# Altium project AMC_FMC_Carrier.PrjPcb (part 5 of 7)

## Sheet Thermometers.SchDoc
size A4; DocumentNumber: 12; SheetNumber: 12; SheetTotal: 30
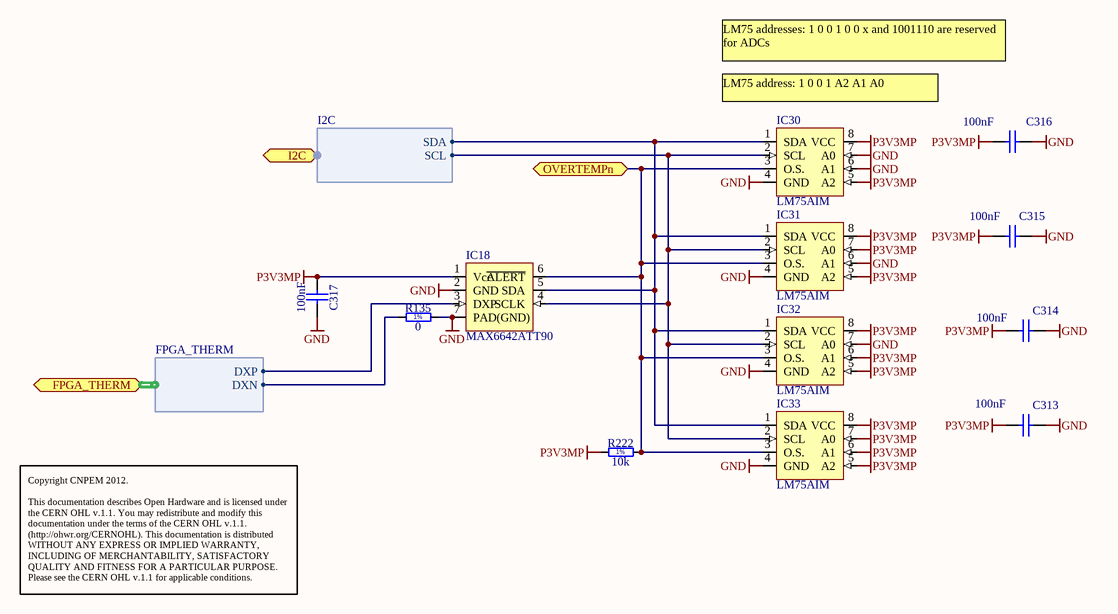
[diagram p13: Thermometers.SchDoc]

### Parts
C313  100nF  [CAPC0603X33N]
C314  100nF  [CAPC0603X33N]
C315  100nF  [CAPC0603X33N]
C316  100nF  [CAPC0603X33N]
C317  100nF  [CAPC0603X33N]
IC18  MAX6642ATT90  [TFDN6]
IC30  LM75AIM  [SOIC127P600X175-8N]
IC31  LM75AIM  [SOIC127P600X175-8N]
IC32  LM75AIM  [SOIC127P600X175-8N]
IC33  LM75AIM  [SOIC127P600X175-8N]
R135  0  [RESC1005X40N]
R222  10k  [RESC1005X40N]

### Ports
FPGA_THERM (harness FPGA_THERM), I2C (harness I2C), OVERTEMPn (bidir)

### Harnesses
FPGA_THERM: DXN, DXP
I2C: SCL, SDA

### Nets
GND: C313.2 C314.2 C315.2 C316.2 C317.2 IC18.2(GND) IC18.7(PAD(GND)) IC30.4(GND) IC30.6(A1) IC30.7(A0) IC31.4(GND) IC31.6(A1) IC32.4(GND) IC32.7(A0) IC33.4(GND) R135.2
P3V3MP: C313.1 C314.1 C315.1 C316.1 C317.1 IC18.1(Vcc) IC30.5(A2) IC30.8(VCC) IC31.5(A2) IC31.7(A0) IC31.8(VCC) IC32.5(A2) IC32.6(A1) IC32.8(VCC) IC33.5(A2) IC33.6(A1) IC33.7(A0) IC33.8(VCC) R222.1
FPGA_ALERTn: IC18.6(~{ALERT}) IC30.3(O.S.) IC31.3(O.S.) IC32.3(O.S.) IC33.3(O.S.) R222.2 ; port OVERTEMPn
FTMP.DXN: R135.1 ; port FPGA_THERM.DXN
FTMP.DXP: IC18.3(DXP) ; port FPGA_THERM.DXP
I2C_CPU.SCL: IC18.4(SCLK) IC30.2(SCL) IC31.2(SCL) IC32.2(SCL) IC33.2(SCL) ; port I2C.SCL
I2C_CPU.SDA: IC18.5(SDA) IC30.1(SDA) IC31.1(SDA) IC32.1(SDA) IC33.1(SDA) ; port I2C.SDA

### Notes on the sheet
- (near IC30) LM75 address: 1 0 0 1 A2 A1 A0
- LM75 addresses: 1 0 0 1 0 0 x and 1001110 are reserved for ADCs
- Copyright CNPEM 2012.
  This documentation describes Open Hardware and is licensed under the CERN OHL v.1.1. You may redistribute and modify this documentation under the terms of the CERN OHL v.1.1. (http://ohwr.org/CERNOHL). This documentation is distributed WITHOUT ANY EXPRESS OR IMPLIED WARRANTY, INCLUDING OF MERCHANTABILITY, SATISFACTORY QUALITY AND FITNESS FOR A PARTICULAR PURPOSE. Please see the CERN OHL v.1.1 for applicable conditions.
- (in symbol R0402_0R_JUMPER) 1%
- (in symbol R0402_10K_1%_0.0625W_100PPM) 1%

### Library data of the parts
C313-C317 = CC0201_100NF_6.3V_10%_X5R: as C616-C621 on sheet UI_mon; Part Number: CC0201_100NF_6.3V_10%_X5R; Component Kind: Standard; Component Type: Standard; Pin Count: 2; Value: 100nF; Status: Not Recommended; Manufacturer Part Number: CC0201_100NF_6.3V_10%_X5R; Case: 0201; Mounted: Yes; Socket: No; SMD: Yes; Manufacturer1 Example: AVX; Manufacturer1 ComponentHeight: 0.33mm; HelpURL: \\cern.ch\dfs\Applications\Altium\Datasheets\CC0201_X5R_AVX.pdf; Author: CERN DEM JLC; CreateDate: 2007-12-03; LatestRevisionDate: 2007-12-03
IC18 = SENS_MAX6642: ±1°C, SMBus- Remote/Local Temperature Sensor with Overtemperature Alarm; Supplier 1: Digi-Key; Supplier Part Number 1: MAX6642ATT90+TCT-ND
IC30-IC33 = SENS_LM75: I2C temperature sensor
R135 = R0402_0R_JUMPER: Resistor - 1%; Part Description: 1A (0.05R Max DC Resistance) Zero Ohm Jumper; Manufacturer: GENERIC; Manufacturer1 Part Number: 232270591001L; Table: Resistors SMD; Part Number: R0402_0R_JUMPER; Component Kind: Standard; Component Type: Standard; Pin Count: 2; Value: 0; Status: Not recommended; Manufacturer Part Number: R0402_0R_JUMPER; Case: 0402; Mounted: Yes; Socket: No; SMD: Yes; Manufacturer1 Example: YAGEO PHYCOMP; Manufacturer1 ComponentHeight: 0.4mm; HelpURL: \\cern.ch\dfs\Applications\Altium\Datasheets\R0402_Phycomp_RC0402.pdf; Author: CERN DEM JLC; CreateDate: 2007-12-03; LatestRevisionDate: 2012-10-17
R222 = R0402_10K_1%_0.0625W_100PPM: Resistor - 1%; Part Description: General Purpose Thick Film Chip Resistor; Manufacturer: GENERIC; Manufacturer1 Part Number: 232270671003L; TC: ±100ppm/°C; Table: Resistors SMD; Part Number: R0402_10K_1%_0.0625W_100PPM; Component Kind: Standard; Component Type: Standard; Pin Count: 2; Value: 10k; Status: Not recommended; Power: 0.0625W; Tolerance: ±1%; Manufacturer Part Number: R0402_10K_1%_0.0625W_100PPM; Case: 0402; Mounted: Yes; Socket: No; SMD: Yes; Manufacturer1 Example: YAGEO PHYCOMP; Manufacturer1 ComponentHeight: 0.4mm; HelpURL: \\cern.ch\dfs\Applications\Altium\Datasheets\R0402_Phycomp_RC0402.pdf; Author: CERN DEM JLC; CreateDate: 2007-12-03; LatestRevisionDate: 2012-10-17

## Sheet USB_UART.SchDoc
size A4; DocumentNumber: 29; SheetNumber: 29; SheetTotal: 30
Used 2 times, as channels IPMI/UUART, UUART. Parts and nets are listed once, with the designators drawn on the sheet.
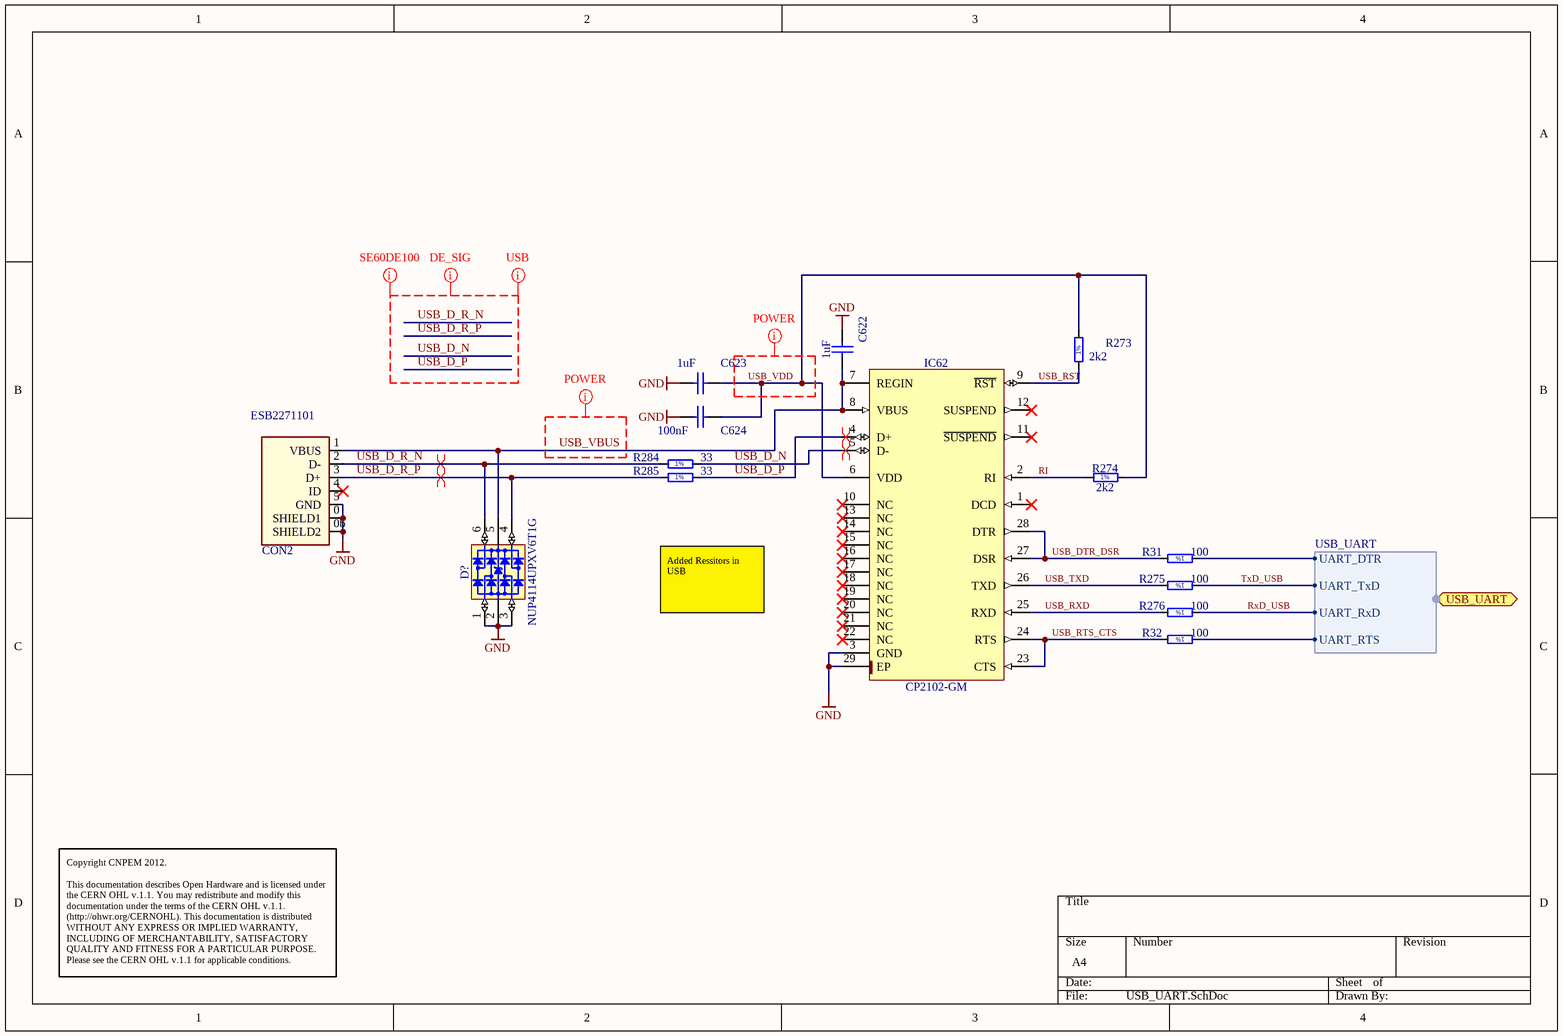
[diagram p14: USB_UART.SchDoc]

### Parts
C622  1uF  [CAPC1608X87N]
C623  1uF  [CAPC1608X87N]
C624  100nF  [CAPC0603X33N]
CON2  ESB2271101  [USB_MICRO_ESB2271101]
D?  NUP4114UPXV6T1G  [SOTFL50P160X60-6N]
IC62  CP2102-GM  [QFN50P500X500X100-29N-S335]
R31  100  [RESC1005X40N]
R32  100  [RESC1005X40N]
R273  2k2  [RESC1005X40N]
R274  2k2  [RESC1005X40N]
R275  100  [RESC1005X40N]
R276  100  [RESC1005X40N]
R284  33  [RESC1005X40N]
R285  33  [RESC1005X40N]

### Ports
USB_UART (harness USB_UART)

### Harnesses
USB_UART: UART_DTR, UART_TxD, UART_RxD, UART_RTS

### Nets
GND: C622.1 C623.1 C624.1 CON2.0(SHIELD1) CON2.0a(SHIELD1) CON2.0b(SHIELD2) CON2.0c(SHIELD2) CON2.5(GND) D?.1(I/O1) D?.2(GND) D?.3(I/O2) IC62.3(GND) IC62.29(EP)
RI: IC62.2(RI) R274.1
RxD_USB: R276.1 ; port USB_UART.UART_RxD
TxD_USB: R275.1 ; port USB_UART.UART_TxD
USB_D_N: IC62.5(D-) R284.2
USB_D_P: IC62.4(D+) R285.2
USB_D_R_N: CON2.2(D-) D?.6(I/O4) R284.1
USB_D_R_P: CON2.3(D+) D?.4(I/O3) R285.1
USB_DTR_DSR: IC62.27(DSR) IC62.28(DTR) R31.2
USB_RST: IC62.9(~{RST}) R273.1
USB_RTS_CTS: IC62.23(CTS) IC62.24(RTS) R32.2
USB_RXD: IC62.25(RXD) R276.2
USB_TXD: IC62.26(TXD) R275.2
USB_VBUS: C622.2 CON2.1(VBUS) D?.5(VBUS) IC62.7(REGIN) IC62.8(VBUS)
USB_VDD: C623.2 C624.2 IC62.6(VDD) R273.2 R274.2
NetR31_1: R31.1 ; port USB_UART.UART_DTR
NetR32_1: R32.1 ; port USB_UART.UART_RTS

Not connected (* = marked no-connect by the designer): CON2 4(ID)*; IC62 1(DCD)* 10(NC)* 11(~{SUSPEND})* 12(SUSPEND)* 13(NC)* 14(NC)* 15(NC)* 16(NC)* 17(NC)* 18(NC)* 19(NC)* 20(NC)* 21(NC)* 22(NC)*

### Channels
IPMI/UUART: designators end in A
UUART: designators end in B

### Layout directives
differential pair: USB_D_N_UUART, USB_D_P_UUART, USB_D_R_N_UUART, USB_D_R_P_UUART
net class POWER: USB_VBUS, USB_VDD
net class SE60DE100: USB_D_N, USB_D_P, USB_D_R_N, USB_D_R_P
net class DE_SIG: USB_D_N, USB_D_P, USB_D_R_N, USB_D_R_P
net class USB: USB_D_N, USB_D_P, USB_D_R_N, USB_D_R_P

### Notes on the sheet
- Added Ressitors in USB
- Copyright CNPEM 2012.
  This documentation describes Open Hardware and is licensed under the CERN OHL v.1.1. You may redistribute and modify this documentation under the terms of the CERN OHL v.1.1. (http://ohwr.org/CERNOHL). This documentation is distributed WITHOUT ANY EXPRESS OR IMPLIED WARRANTY, INCLUDING OF MERCHANTABILITY, SATISFACTORY QUALITY AND FITNESS FOR A PARTICULAR PURPOSE. Please see the CERN OHL v.1.1 for applicable conditions.
- (in symbol R0402_2K2_1%_0.0625W_100PPM) 1%
- (in symbol R0402_33R_1%_0.0625W_100PPM) 1%
- (in symbol R0402_100R_1%_0.0625W_100PPM) 1%

### Library data of the parts
C622 C623 = CC0603_1UF_16V_10%_X7R: Non-polarised capacitor; Part Description: SMD Multilayer Chip Ceramic Capacitor; Manufacturer: GENERIC; Manufacturer1 Part Number: 223824613663; Voltage: 16V; TC: X7R; Tolerance: ±10%; Table: Capacitors SMD; Part Number: CC0603_1UF_16V_10%_X7R; Component Kind: Standard; Component Type: Standard; Pin Count: 2; Value: 1uF; Status: Preferred; Manufacturer Part Number: CC0603_1uF_16V_10%_X7R; Case: 0603; Mounted: Yes; Socket: No; SMD: Yes; Manufacturer1 Example: PHYCOMP; Manufacturer1 ComponentHeight: 0.87mm; HelpURL: \\cern.ch\dfs\Applications\Altium\Datasheets\CC0805_X5R_PHYCOMP_HC.pdf; Author: CERN DEM JLC; CreateDate: 2007-12-03; LatestRevisionDate: 2007-12-03
C624 = CC0201_100NF_6.3V_10%_X5R: as C616-C621 on sheet UI_mon; Part Number: CC0201_100NF_6.3V_10%_X5R; Component Kind: Standard; Component Type: Standard; Pin Count: 2; Value: 100nF; Status: Not Recommended; Manufacturer Part Number: CC0201_100NF_6.3V_10%_X5R; Case: 0201; Mounted: Yes; Socket: No; SMD: Yes; Manufacturer1 Example: AVX; Manufacturer1 ComponentHeight: 0.33mm; HelpURL: \\cern.ch\dfs\Applications\Altium\Datasheets\CC0201_X5R_AVX.pdf; Author: CERN DEM JLC; CreateDate: 2007-12-03; LatestRevisionDate: 2007-12-03
CON2 = CON_USB_AB_MICRO: USB micro AB connector; Part Number: 10133; Device: USB_Mini_AB
D? = NUP4114UPXV6T1G: Part Description: ESD Protection Diodes Array (8kV) with Low Clamping Voltage; Manufacturer: ON SEMICONDUCTOR; Voltage: 5.5V; PressFit: No; Bonding: No; Part Number: NUP4114UPXV6T1G; Component Kind: Standard; Component Type: Standard; Device: NUP4114UPXV6T1G; PackageDescription: SOTFL (SOT666, SOT563,), 0.50mm, Pitch; 6 Pin, 1.20mm W X 1.60mm L X 0.60mm H Body, IPC Medium Density; Manufacturer Part Number: NUP4114UPXV6T1G; Pin Count: 8; Mounted: Yes; Socket: No; SMD: Yes; Sense: No; ComponentHeight: 1.75mm; HelpURL: \\cern.ch\dfs\Applications\Altium\Datasheets\NUP4114UPXV6T1G.pdf; Author: CERN DEM JLC; CreateDate: 05/12/2012; LatestRevisionDate: 05/12/2012
IC62 = CP2102-GM: Single-Chip USB to UART Bridge; Manufacturer: SILICON LABS; Table: Analog & Interface; Part Number: CP2102-GM; Component Kind: Standard; Component Type: Standard; Device: CP2102-GM; PackageDescription: QFN, 0.50mm Pitch, Square; 28 pin, 5.00mm L X 5.00mm W X 1.00mm H body (w/thermal tab 3.35 X 3.35mm),  IPC Medium Density; Part Description: Single-Chip USB to UART Bridge; Manufacturer Part Number: CP2102-GM; Pin Count: 29; Case: QFN28; Mounted: Yes; Socket: No; SMD: Yes; ComponentHeight: 1.0mm; Author: CERN DEM JLC; HelpURL: \\cern.ch\dfs\Applications\Altium\Datasheets\CP2102-GM.pdf; CreateDate: 3/3/2011; LatestRevisionDate: 3/3/2011
R31 R32 R275 R276 = R0402_100R_1%_0.0625W_100PPM: Resistor - 1%; Part Description: General Purpose Thick Film Chip Resistor; Manufacturer: GENERIC; Manufacturer1 Part Number: 232270671001L; TC: ±100ppm/°C; Part Number: R0402_100R_1%_0.0625W_100PPM; Component Kind: Standard; Component Type: Standard; Pin Count: 2; Value: 100; Status: Not recommended; Power: 0.0625W; Tolerance: ±1%; Manufacturer Part Number: R0402_100R_1%_0.0625W_100PPM; Case: 0402; Mounted: Yes; Socket: No; SMD: Yes; Manufacturer1 Example: YAGEO PHYCOMP; Manufacturer1 ComponentHeight: 0.4mm; HelpURL: \\cern.ch\dfs\Applications\Altium\Datasheets\R0402_Phycomp_RC0402.pdf; Author: CERN DEM JLC; CreateDate: 03/12/2007; LatestRevisionDate: 17/10/2012; Sense: No
R273 R274 = R0402_2K2_1%_0.0625W_100PPM: Resistor - 1%; Part Description: General Purpose Thick Film Chip Resistor; Manufacturer: GENERIC; Manufacturer1 Part Number: 232270672202L; TC: ±100ppm/°C; Table: Resistors SMD; Part Number: R0402_2K2_1%_0.0625W_100PPM; Component Kind: Standard; Component Type: Standard; Pin Count: 2; Value: 2k2; Status: Not recommended; Power: 0.0625W; Tolerance: ±1%; Manufacturer Part Number: R0402_2K2_1%_0.0625W_100PPM; Case: 0402; Mounted: Yes; Socket: No; SMD: Yes; Manufacturer1 Example: YAGEO PHYCOMP; Manufacturer1 ComponentHeight: 0.4mm; HelpURL: \\cern.ch\dfs\Applications\Altium\Datasheets\R0402_Phycomp_RC0402.pdf; Author: CERN DEM JLC; CreateDate: 2007-12-03; LatestRevisionDate: 2012-10-17
R284 R285 = R0402_33R_1%_0.0625W_100PPM: Resistor - 1%; Part Description: General Purpose Thick Film Chip Resistor; Manufacturer: GENERIC; Manufacturer1 Part Number: 232270673309L; TC: ±100ppm/°C; Table: Resistors SMD; Part Number: R0402_33R_1%_0.0625W_100PPM; Component Kind: Standard; Component Type: Standard; Pin Count: 2; Value: 33; Status: Not recommended; Power: 0.0625W; Tolerance: ±1%; Manufacturer Part Number: R0402_33R_1%_0.0625W_100PPM; Case: 0402; Mounted: Yes; Socket: No; SMD: Yes; Manufacturer1 Example: YAGEO PHYCOMP; Manufacturer1 ComponentHeight: 0.4mm; HelpURL: \\cern.ch\dfs\Applications\Altium\Datasheets\R0402_Phycomp_RC0402.pdf; Author: CERN DEM JLC; CreateDate: 2007-12-03; LatestRevisionDate: 2012-10-17

## Sheet JTAG_Configuration.SchDoc
size A4; DocumentNumber: 8; SheetNumber: 8; SheetTotal: 30
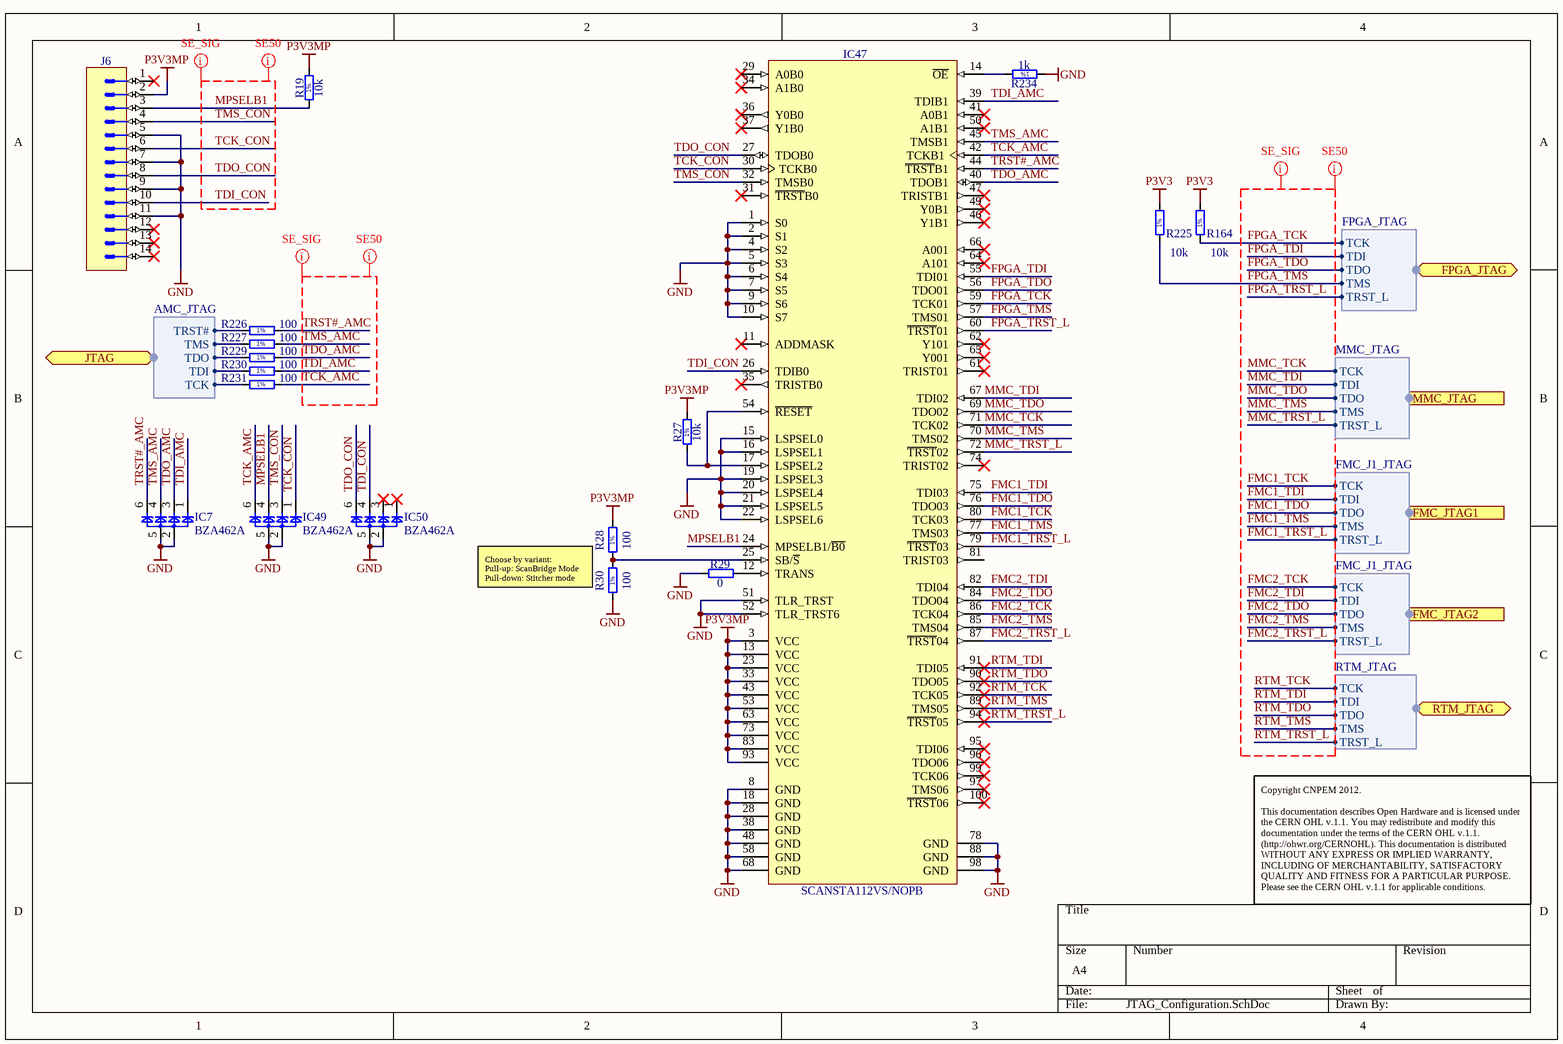
[diagram p15: JTAG_Configuration.SchDoc]

### Parts
IC7  BZA462A  [SOT23-6]
IC47  SCANSTA112VS/NOPB  [QFP50P1600X1600X120-100N]
IC49  BZA462A  [SOT23-6]
IC50  BZA462A  [SOT23-6]
J6  Milli-Grid™  [MOLEX_87832-1420]  (value not drawn)
R19  10k  [RESC1608X55N]
R27  10k  [RESC1608X55N]
R28  100  [RESC1005X40N]
R29  0  [RESC1608X55N]
R30  100  [RESC1005X40N]
R164  10k  [RESC1005X40N]
R225  10k  [RESC1005X40N]
R226  100  [RESC1005X40N]
R227  100  [RESC1005X40N]
R229  100  [RESC1005X40N]
R230  100  [RESC1005X40N]
R231  100  [RESC1005X40N]
R234  1k  [RESC1005X40N]

### Ports
FMC_JTAG1 (harness FMC_J1_JTAG), FMC_JTAG2 (harness FMC_J1_JTAG), FPGA_JTAG (harness FPGA_JTAG), JTAG (harness AMC_JTAG), MMC_JTAG (harness MMC_JTAG), RTM_JTAG (harness RTM_JTAG)

### Harnesses
AMC_JTAG: TCK, TDI, TDO, TMS, TRST#
RTM_JTAG: TCK, TDI, TDO, TMS, TRST_L
FPGA_JTAG: TCK, TDI, TDO, TMS, TRST_L
FMC_J1_JTAG: TCK, TDI, TDO, TMS, TRST_L
MMC_JTAG: TCK, TDI, TDO, TMS, TRST_L

### Nets
GND: IC7.2 IC7.5 IC47.1(S0) IC47.2(S1) IC47.4(S2) IC47.5(S3) IC47.6(S4) IC47.7(S5) IC47.8(GND) IC47.9(S6) IC47.10(S7) IC47.15(LSPSEL0) IC47.16(LSPSEL1) IC47.18(GND) IC47.19(LSPSEL3) IC47.20(LSPSEL4) IC47.21(LSPSEL5) IC47.22(LSPSEL6) IC47.28(GND) IC47.38(GND) IC47.48(GND) IC47.51(TLR_TRST) IC47.52(TLR_TRST6) IC47.58(GND) IC47.68(GND) IC47.78(GND) IC47.88(GND) IC47.98(GND) IC49.2 IC49.5 IC50.2 IC50.5 J6.5 J6.7 J6.9 J6.11 R29.1 R30.1 R234.1
P3V3: R164.2 R225.2
P3V3MP: IC47.3(VCC) IC47.13(VCC) IC47.23(VCC) IC47.33(VCC) IC47.43(VCC) IC47.53(VCC) IC47.63(VCC) IC47.73(VCC) IC47.83(VCC) IC47.93(VCC) J6.2 R19.2 R27.2 R28.2
AJTAG.TCK: R231.1 ; port JTAG.TCK
AJTAG.TDI: R230.1 ; port JTAG.TDI
AJTAG.TDO: R229.1 ; port JTAG.TDO
AJTAG.TMS: R227.1 ; port JTAG.TMS
AJTAG.TRST#: R226.1 ; port JTAG.TRST#
FMC1_TCK: IC47.80(TCK03) ; port FMC_JTAG1.TCK  [project net JTAG1.TCK]
FMC1_TDI: IC47.75(TDI03) ; port FMC_JTAG1.TDI  [project net JTAG1.TDI]
FMC1_TDO: IC47.76(TDO03) ; port FMC_JTAG1.TDO  [project net JTAG1.TDO]
FMC1_TMS: IC47.77(TMS03) ; port FMC_JTAG1.TMS  [project net JTAG1.TMS]
FMC1_TRST_L: IC47.79(~{TRST}03) ; port FMC_JTAG1.TRST_L  [project net JTAG1.TRST_L]
FMC2_TCK: IC47.86(TCK04) ; port FMC_JTAG2.TCK  [project net JTAG2.TCK]
FMC2_TDI: IC47.82(TDI04) ; port FMC_JTAG2.TDI  [project net JTAG2.TDI]
FMC2_TDO: IC47.84(TDO04) ; port FMC_JTAG2.TDO  [project net JTAG2.TDO]
FMC2_TMS: IC47.85(TMS04) ; port FMC_JTAG2.TMS  [project net JTAG2.TMS]
FMC2_TRST_L: IC47.87(~{TRST}04) ; port FMC_JTAG2.TRST_L  [project net JTAG2.TRST_L]
FPGA_TCK: IC47.59(TCK01) R164.1 ; port FPGA_JTAG.TCK  [project net FJTAG.TCK]
FPGA_TDI: IC47.55(TDI01) ; port FPGA_JTAG.TDI  [project net FJTAG.TDI]
FPGA_TDO: IC47.56(TDO01) ; port FPGA_JTAG.TDO  [project net FJTAG.TDO]
FPGA_TMS: IC47.57(TMS01) R225.1 ; port FPGA_JTAG.TMS  [project net FJTAG.TMS]
FPGA_TRST_L: IC47.60(~{TRST}01) ; port FPGA_JTAG.TRST_L  [project net FJTAG.TRST_L]
MMC_TCK: IC47.71(TCK02) ; port MMC_JTAG.TCK
MMC_TDI: IC47.67(TDI02) ; port MMC_JTAG.TDI
MMC_TDO: IC47.69(TDO02) ; port MMC_JTAG.TDO
MMC_TMS: IC47.70(TMS02) ; port MMC_JTAG.TMS
MMC_TRST_L: IC47.72(~{TRST}02) ; port MMC_JTAG.TRST_L
MPSELB1: IC47.24(MPSELB1/~{B0}) IC49.4 J6.3 R19.1
RTM_TCK: IC47.92(TCK05) ; port RTM_JTAG.TCK
RTM_TDI: IC47.91(TDI05) ; port RTM_JTAG.TDI
RTM_TDO: IC47.90(TDO05) ; port RTM_JTAG.TDO
RTM_TMS: IC47.89(TMS05) ; port RTM_JTAG.TMS
RTM_TRST_L: IC47.94(~{TRST}05) ; port RTM_JTAG.TRST_L
TCK_AMC: IC47.42(TCKB1) IC49.6 R231.2
TCK_CON: IC47.30(TCKB0) IC49.1 J6.6
TDI_AMC: IC7.1 IC47.39(TDIB1) R230.2
TDI_CON: IC47.26(TDIB0) IC50.4 J6.10
TDO_AMC: IC7.3 IC47.40(TDOB1) R229.2
TDO_CON: IC47.27(TDOB0) IC50.6 J6.8
TMS_AMC: IC7.4 IC47.45(TMSB1) R227.2
TMS_CON: IC47.32(TMSB0) IC49.3 J6.4
TRST#_AMC: IC7.6 IC47.44(~{TRST}B1) R226.2
NetIC47_12: IC47.12(TRANS) R29.2
NetIC47_14: IC47.14(~{OE}) R234.2
NetIC47_17: IC47.17(LSPSEL2) IC47.54(~{RESET}) R27.1
NetIC47_25: IC47.25(SB/~{S}) R28.1 R30.2

Not connected (* = marked no-connect by the designer): IC47 11(ADDMASK)* 29(A0B0)* 31(~{TRST}B0)* 34(A1B0)* 35(TRISTB0)* 36(Y0B0)* 37(Y1B0)* 41(A0B1)* 46(Y1B1)* 47(TRISTB1)* 49(Y0B1)* 50(A1B1)* 61(TRIST01)* 62(Y101)* 64(A101)* 65(Y001)* 66(A001)* 74(TRIST02)* 81(TRIST03) 95(TDI06)* 96(TDO06)* 97(TMS06)* 99(TCK06)* 100(~{TRST}06)*; IC50 1* 3*; J6 1* 12* 13* 14*

### Layout directives
net class SE_SIG: FMC1_TCK, FMC1_TDI, FMC1_TDO, FMC1_TMS, FMC1_TRST_L, FMC2_TCK, FMC2_TDI, FMC2_TDO, FMC2_TMS, FMC2_TRST_L, FPGA_TCK, FPGA_TDI, FPGA_TDO, FPGA_TMS, FPGA_TRST_L, MMC_TCK, MMC_TDI, MMC_TDO, MMC_TMS, MMC_TRST_L, MPSELB1, RTM_TCK, RTM_TDI, RTM_TDO, RTM_TMS, RTM_TRST_L, TCK_AMC, TCK_CON, TDI_AMC, TDI_CON, TDO_AMC, TDO_CON, TMS_AMC, TMS_CON, TRST#_AMC
net class SE50: FMC1_TCK, FMC1_TDI, FMC1_TDO, FMC1_TMS, FMC1_TRST_L, FMC2_TCK, FMC2_TDI, FMC2_TDO, FMC2_TMS, FMC2_TRST_L, FPGA_TCK, FPGA_TDI, FPGA_TDO, FPGA_TMS, FPGA_TRST_L, MMC_TCK, MMC_TDI, MMC_TDO, MMC_TMS, MMC_TRST_L, MPSELB1, RTM_TCK, RTM_TDI, RTM_TDO, RTM_TMS, RTM_TRST_L, TCK_AMC, TCK_CON, TDI_AMC, TDI_CON, TDO_AMC, TDO_CON, TMS_AMC, TMS_CON, TRST#_AMC

### Notes on the sheet
- Choose by variant:
  Pull-up: ScanBridge Mode
  Pull-down: Stitcher mode
- Copyright CNPEM 2012.
  This documentation describes Open Hardware and is licensed under the CERN OHL v.1.1. You may redistribute and modify this documentation under the terms of the CERN OHL v.1.1. (http://ohwr.org/CERNOHL). This documentation is distributed WITHOUT ANY EXPRESS OR IMPLIED WARRANTY, INCLUDING OF MERCHANTABILITY, SATISFACTORY QUALITY AND FITNESS FOR A PARTICULAR PURPOSE. Please see the CERN OHL v.1.1 for applicable conditions.
- (in symbol R0402_1K_1%_0.0625W_100PPM) 1%
- (in symbol R0402_10K_1%_0.0625W_100PPM) 1%
- (in symbol R0402_100R_1%_0.0625W_100PPM) 1%
- (in symbol R0603_10K_1%_0.1W_100PPM) 1%

### Library data of the parts
IC7 IC49 IC50 = D_TVS_BZA462A: Quadruple 4V ESD transient voltage suppressor; Supplier 1: Newark; Supplier Part Number 1: 79R1868
IC47 = SCANSTA112VS/NOPB: 7-Port Multidrop IEEE 1149.1 (JTAG) Multiplexer; Manufacturer: TEXAS INSTRUMENTS; PressFit: No; Bonding: No; Part Number: SCANSTA112VS/NOPB; Component Kind: Standard; Component Type: Standard; Device: SCANSTA112VS/NOPB; PackageDescription: QFP, 0.50mm Pitch, Square; 100 Pin,14.00mm L X 14.00mm W X 1.20mm H Body, IPC Medium Density; Part Description: 7-Port Multidrop IEEE 1149.1 (JTAG) Multiplexer; Manufacturer Part Number: SCANSTA112VS/NOPB; Pin Count: 100; Case: QFP100; Mounted: Yes; Socket: No; SMD: Yes; Sense: No; ComponentHeight: 1.2mm; Author: CERN DEM JLC; HelpURL: \\cern.ch\dfs\Applications\Altium\Datasheets\SCANSTA112VS-NOPB.pdf; CreateDate: 27/10/2016; LatestRevisionDate: 27/10/2016
J6 = MOLEX_87832-1420: Connector 14 Male; Part Description: 2.00mm (.079") Pitch Milli-Grid™ Header, Surface Mount, Vertical, Shrouded, 14 Circuits,with Locking Windows and Centre Polarization Slot, PCB Locator; Manufacturer: MOLEX; Part Number: MOLEX_87832-1420; Component Kind: Standard; Component Type: Standard; Pin Count: 14; Family: Milli-Grid™; Mounted: Yes; Socket: No; SMD: Yes; Status: None; Manufacturer Part Number: 87832-1420; ComponentHeight: 6.4mm; HelpURL: \\cern.ch\dfs\Applications\Altium\Datasheets\MOLEX_87832-1420.pdf; Author: CERN DEM JLC; CreateDate: 2008-09-09; LatestRevisionDate: 2008-09-09; Table: MOLEX
R19 R27 = R0603_10K_1%_0.1W_100PPM: Resistor - 1%; Part Description: General Purpose Thick Film Chip Resistor; Manufacturer: GENERIC; Manufacturer1 Part Number: NRC06F1002TRF; Power: 0.1W; TC: ±100ppm/°C; Part Number: R0603_10K_1%_0.1W_100PPM; Component Kind: Standard; Component Type: Standard; Pin Count: 2; Value: 10k; Status: Preferred; Tolerance: ±1%; Manufacturer Part Number: R0603_10K_1%_0.1W_100PPM; Case: 0603; Mounted: Yes; Sense: No; Socket: No; SMD: Yes; Manufacturer1 Example: NIC COMPONENT; Manufacturer1 ComponentHeight: 0.55mm; HelpURL: \\cern.ch\dfs\Applications\Altium\Datasheets\R0603_NIC_NRC.pdf; Author: CERN DEM JLC; CreateDate: 03/12/2007; LatestRevisionDate: 13/03/2008
R28 R30 R226 R227 R229-R231 = R0402_100R_1%_0.0625W_100PPM: Resistor - 1%; Part Description: General Purpose Thick Film Chip Resistor; Manufacturer: GENERIC; Manufacturer1 Part Number: 232270671001L; TC: ±100ppm/°C; Table: Resistors SMD; Part Number: R0402_100R_1%_0.0625W_100PPM; Component Kind: Standard; Component Type: Standard; Pin Count: 2; Value: 100; Status: Not recommended; Power: 0.0625W; Tolerance: ±1%; Manufacturer Part Number: R0402_100R_1%_0.0625W_100PPM; Case: 0402; Mounted: Yes; Socket: No; SMD: Yes; Manufacturer1 Example: YAGEO PHYCOMP; Manufacturer1 ComponentHeight: 0.4mm; HelpURL: \\cern.ch\dfs\Applications\Altium\Datasheets\R0402_Phycomp_RC0402.pdf; Author: CERN DEM JLC; CreateDate: 2007-12-03; LatestRevisionDate: 2012-10-17
R29 = R0603_0R_JUMPER: Resistor; Part Description: 1A (0.05R Max DC Resistance) Zero Ohm Jumper; Manufacturer: GENERIC; Manufacturer1 Part Number: NRC06Z0; Part Number: R0603_0R_JUMPER; Component Kind: Standard; Component Type: Standard; Pin Count: 2; Value: 0; Status: Preferred; Manufacturer Part Number: R0603_0R_JUMPER; Case: 0603; Mounted: Yes; Sense: No; Socket: No; SMD: Yes; Manufacturer1 Example: NIC COMPONENT; Manufacturer1 ComponentHeight: 0.55mm; HelpURL: \\cern.ch\dfs\Applications\Altium\Datasheets\R0603_NIC_NRC.pdf; Author: CERN DEM JLC; CreateDate: 03/12/2007; LatestRevisionDate: 13/03/2008
R164 R225 = R0402_10K_1%_0.0625W_100PPM: as R222 on sheet Thermometers; Part Number: R0402_10K_1%_0.0625W_100PPM; Component Kind: Standard; Component Type: Standard; Pin Count: 2; Value: 10k; Status: Not recommended; Power: 0.0625W; Tolerance: ±1%; Manufacturer Part Number: R0402_10K_1%_0.0625W_100PPM; Case: 0402; Mounted: Yes; Socket: No; SMD: Yes; Manufacturer1 Example: YAGEO PHYCOMP; Manufacturer1 ComponentHeight: 0.4mm; HelpURL: \\cern.ch\dfs\Applications\Altium\Datasheets\R0402_Phycomp_RC0402.pdf; Author: CERN DEM JLC; CreateDate: 2007-12-03; LatestRevisionDate: 2012-10-17
R234 = R0402_1K_1%_0.0625W_100PPM: Resistor - 1%; Part Description: General Purpose Thick Film Chip Resistor; Manufacturer: GENERIC; Manufacturer1 Part Number: 232270671002L; TC: ±100ppm/°C; Table: Resistors SMD; Part Number: R0402_1K_1%_0.0625W_100PPM; Component Kind: Standard; Component Type: Standard; Pin Count: 2; Value: 1k; Status: Not recommended; Power: 0.0625W; Tolerance: ±1%; Manufacturer Part Number: R0402_1K_1%_0.0625W_100PPM; Case: 0402; Mounted: Yes; Socket: No; SMD: Yes; Manufacturer1 Example: YAGEO PHYCOMP; Manufacturer1 ComponentHeight: 0.4mm; HelpURL: \\cern.ch\dfs\Applications\Altium\Datasheets\R0402_Phycomp_RC0402.pdf; Author: CERN DEM JLC; CreateDate: 2007-12-03; LatestRevisionDate: 2012-10-17

## Sheet RTM_CON.SchDoc
size A3; DocumentNumber: 21; SheetNumber: 21; SheetTotal: 30
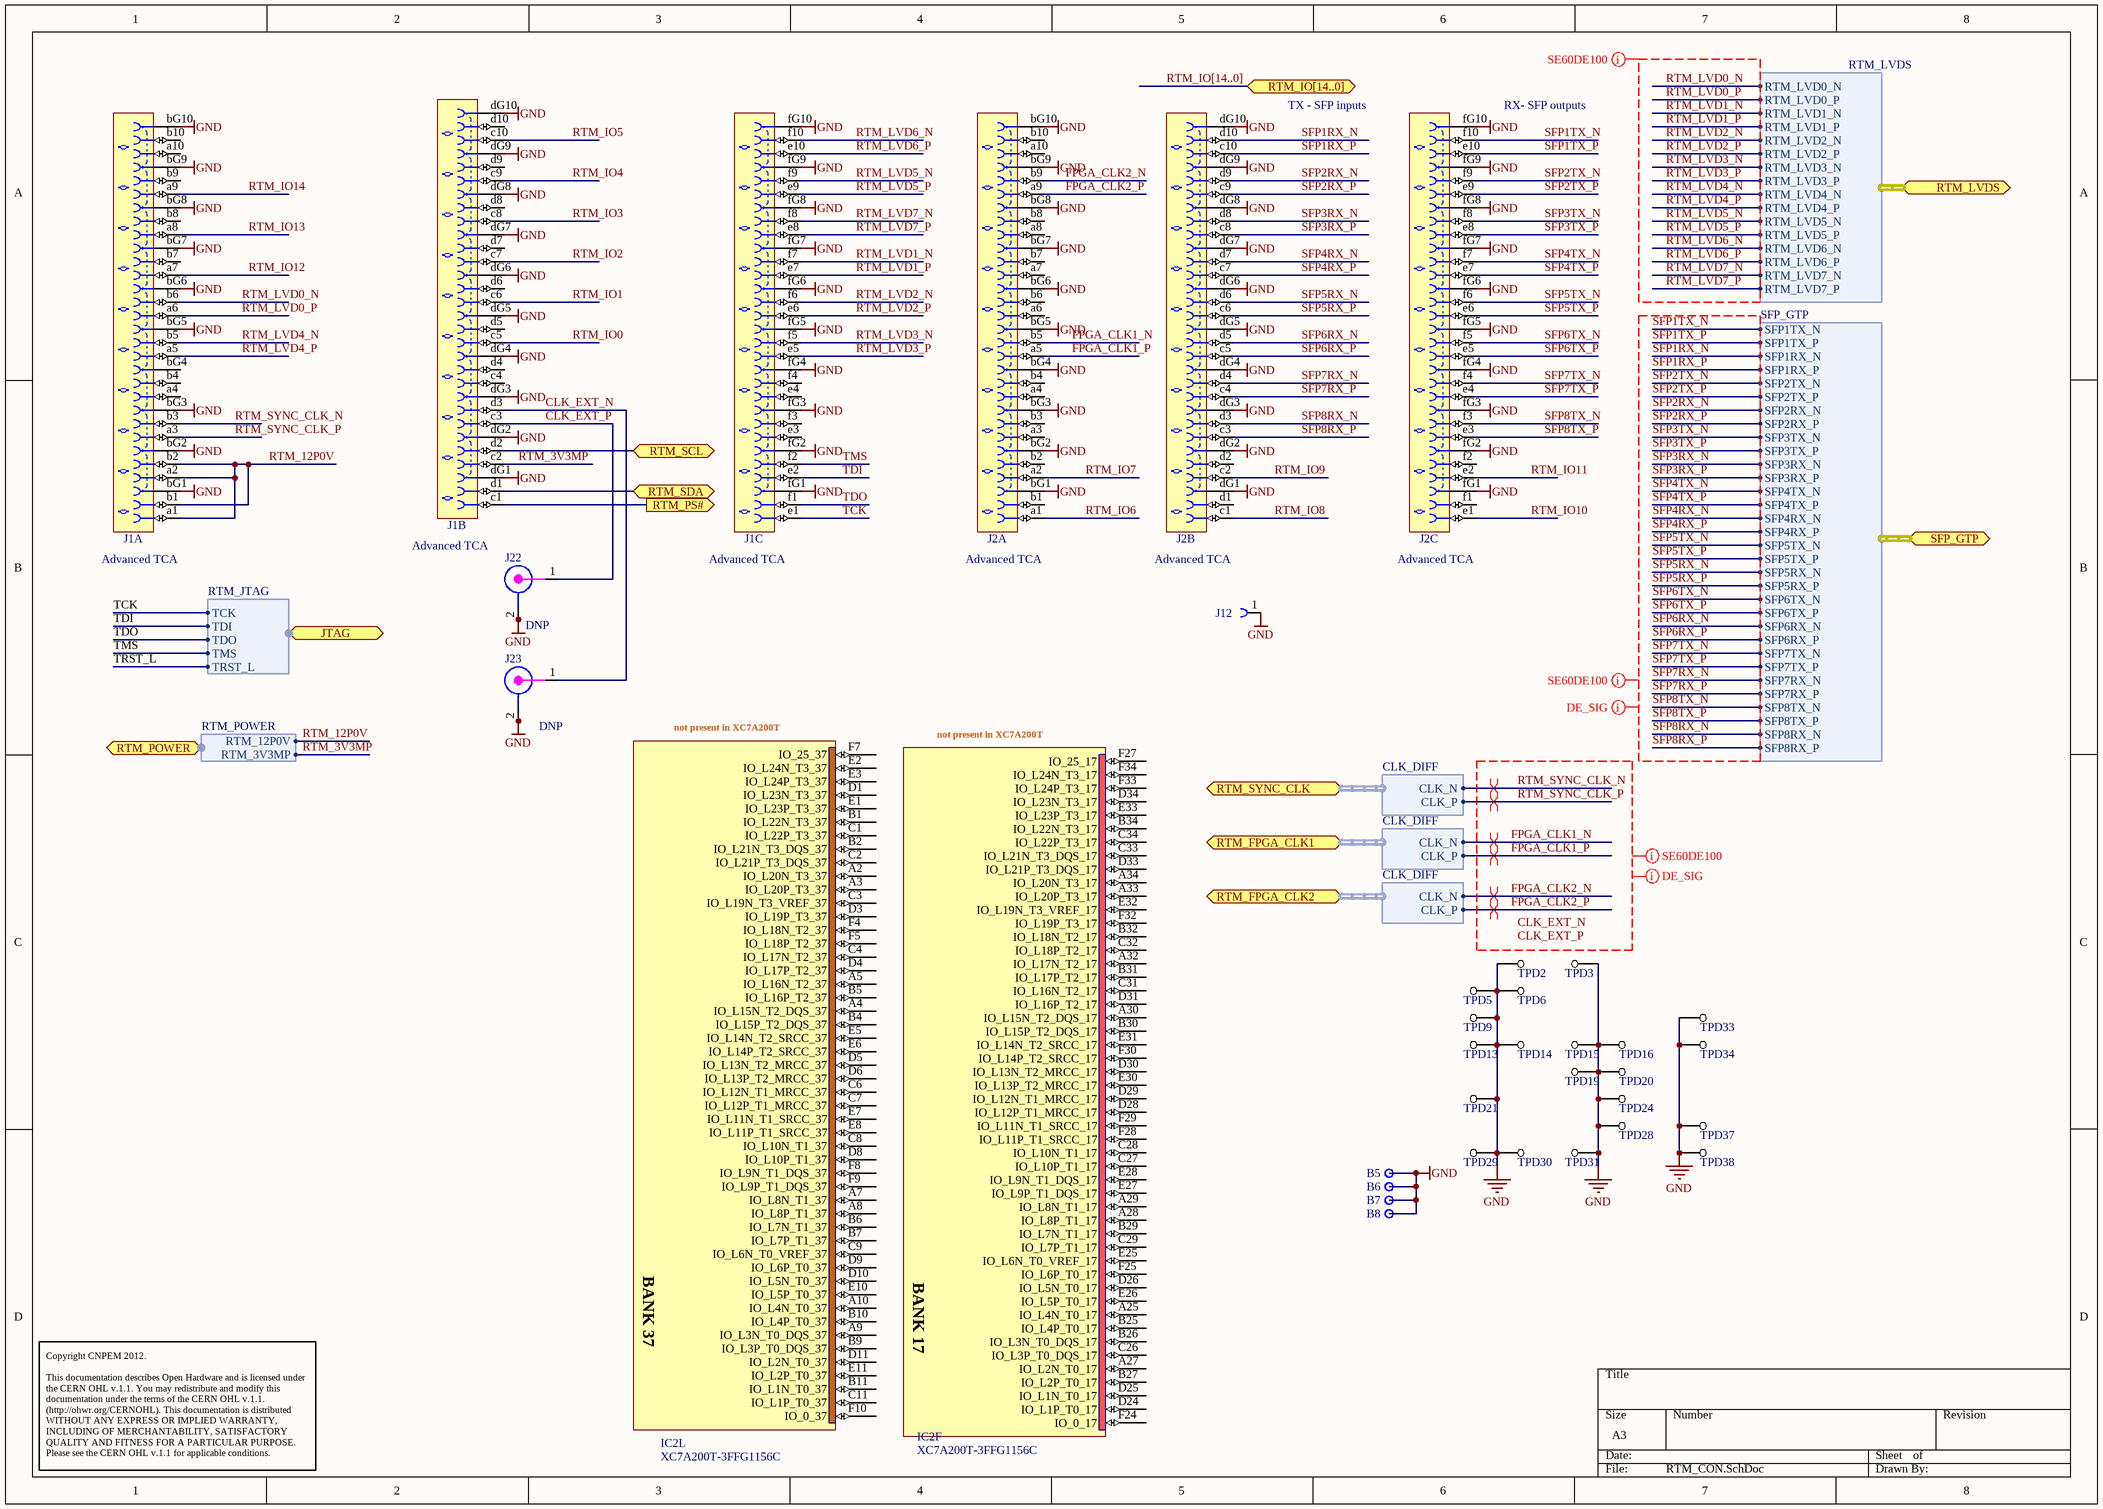
[diagram p16: RTM_CON.SchDoc]

### Parts
(Parts that share a designator on the sheet are numbered #1, #2 ... from top to bottom, then left to right.)
B5  Test Point  [VERO_20-2136]  (value not drawn)
B6  Test Point  [VERO_20-2136]  (value not drawn)
B7  Test Point  [VERO_20-2136]  (value not drawn)
B8  Test Point  [VERO_20-2136]  (value not drawn)
IC2#2  XC7A200T-3FFG1156C  [BGA1156C100P34X34_3500X3500X335]  (parts F,L of 23)
J1  Advanced TCA  [TYCO_6469081-1]  (parts A,B,C of 3)
J2  Advanced TCA  [TYCO_6469081-1]  (parts A,B,C of 3)
J12  (no value)  [TYCO_5120913-1]
J22  DNP  [CON_UFL_HIROSE_RECEPTACLE]
J23  DNP  [CON_UFL_HIROSE_RECEPTACLE]
TPD2  Test Point  [TP_DIFF_0805]  (value not drawn)
TPD3  Test Point  [TP_DIFF_0805]  (value not drawn)
TPD5  Test Point  [TP_DIFF_0805]  (value not drawn)
TPD6  Test Point  [TP_DIFF_0805]  (value not drawn)
TPD9  Test Point  [TP_DIFF_0805]  (value not drawn)
TPD13  Test Point  [TP_DIFF_0805]  (value not drawn)
TPD14  Test Point  [TP_DIFF_0805]  (value not drawn)
TPD15  Test Point  [TP_DIFF_0805]  (value not drawn)
TPD16  Test Point  [TP_DIFF_0805]  (value not drawn)
TPD19  Test Point  [TP_DIFF_0805]  (value not drawn)
TPD20  Test Point  [TP_DIFF_0805]  (value not drawn)
TPD21  Test Point  [TP_DIFF_0805]  (value not drawn)
TPD24  Test Point  [TP_DIFF_0805]  (value not drawn)
TPD28  Test Point  [TP_DIFF_0805]  (value not drawn)
TPD29  Test Point  [TP_DIFF_0805]  (value not drawn)
TPD30  Test Point  [TP_DIFF_0805]  (value not drawn)
TPD31  Test Point  [TP_DIFF_0805]  (value not drawn)
TPD33  Test Point  [TP_DIFF_0805]  (value not drawn)
TPD34  Test Point  [TP_DIFF_0805]  (value not drawn)
TPD37  Test Point  [TP_DIFF_0805]  (value not drawn)
TPD38  Test Point  [TP_DIFF_0805]  (value not drawn)

### Ports
JTAG (harness RTM_JTAG), RTM_FPGA_CLK1 (harness CLK_DIFF), RTM_FPGA_CLK2 (harness CLK_DIFF), RTM_IO[14..0] (bidir, harness JTAG), RTM_LVDS (harness RTM_LVDS), RTM_POWER (harness RTM_POWER), RTM_PS# (out), RTM_SCL (bidir), RTM_SDA (bidir), RTM_SYNC_CLK (harness CLK_DIFF), SFP_GTP (harness SFP_GTP)

### Harnesses
RTM_LVDS: RTM_LVD0_N, RTM_LVD0_P, RTM_LVD1_N, RTM_LVD1_P, RTM_LVD2_N, RTM_LVD2_P, RTM_LVD3_N, RTM_LVD3_P, RTM_LVD4_N, RTM_LVD4_P, RTM_LVD5_N, RTM_LVD5_P, RTM_LVD6_N, RTM_LVD6_P, RTM_LVD7_N, RTM_LVD7_P
SFP_GTP: SFP1RX_N, SFP1RX_P, SFP1TX_N, SFP1TX_P, SFP2TX_N, SFP2TX_P, SFP2RX_N, SFP2RX_P, SFP3TX_N, SFP3TX_P, SFP3RX_N, SFP3RX_P, SFP4TX_N, SFP4TX_P, SFP4RX_N, SFP4RX_P, SFP5TX_N, SFP5TX_P, SFP5RX_N, SFP5RX_P, SFP6TX_N, SFP6TX_P, SFP6RX_N, SFP6RX_P, SFP7TX_N, SFP7TX_P, SFP7RX_N, SFP7RX_P, SFP8TX_N, SFP8TX_P, SFP8RX_N, SFP8RX_P
CLK_DIFF: CLK_P, CLK_N
RTM_JTAG: TCK, TDI, TDO, TMS, TRST_L
RTM_POWER: RTM_12P0V, RTM_3V3MP

### Nets
GND: B5.1 B6.1 B7.1 B8.1 J1.bG1 J1.bG2 J1.bG3 J1.bG5 J1.bG6 J1.bG7 J1.bG8 J1.bG9 J1.bG10 J1.dG1 J1.dG2 J1.dG3 J1.dG4 J1.dG5 J1.dG6 J1.dG7 J1.dG8 J1.dG9 J1.dG10 J1.fG1 J1.fG2 J1.fG3 J1.fG4 J1.fG5 J1.fG6 J1.fG7 J1.fG8 J1.fG9 J1.fG10 J2.bG1 J2.bG2 J2.bG3 J2.bG4 J2.bG5 J2.bG6 J2.bG7 J2.bG8 J2.bG9 J2.bG10 J2.dG1 J2.dG2 J2.dG3 J2.dG4 J2.dG5 J2.dG6 J2.dG7 J2.dG8 J2.dG9 J2.dG10 J2.fG1 J2.fG2 J2.fG3 J2.fG4 J2.fG5 J2.fG6 J2.fG7 J2.fG8 J2.fG9 J2.fG10 J12.1 J22.2 J22.2a(GND) J23.2 J23.2a(GND) TPD2.1(TP) TPD3.1(TP) TPD5.1(TP) TPD6.1(TP) TPD9.1(TP) TPD13.1(TP) TPD14.1(TP) TPD15.1(TP) TPD16.1(TP) TPD19.1(TP) TPD20.1(TP) TPD21.1(TP) TPD24.1(TP) TPD28.1(TP) TPD29.1(TP) TPD30.1(TP) TPD31.1(TP) TPD33.1(TP) TPD34.1(TP) TPD37.1(TP) TPD38.1(TP)
CLK_EXT_N: J1.d3 J23.1
CLK_EXT_P: J1.c3 J22.1
FPGA_CLK1_N: J2.b5 ; port RTM_FPGA_CLK1.CLK_N
FPGA_CLK1_P: J2.a5 ; port RTM_FPGA_CLK1.CLK_P
FPGA_CLK2_N: J2.b9 ; port RTM_FPGA_CLK2.CLK_N
FPGA_CLK2_P: J2.a9 ; port RTM_FPGA_CLK2.CLK_P
RTM_3V3MP: J1.c2 ; port RTM_POWER.RTM_3V3MP
RTM_12P0V: J1.a1 J1.a2 J1.b1 J1.b2 ; port RTM_POWER.RTM_12P0V
RTM_IO0: J1.c5
RTM_IO1: J1.c6
RTM_IO2: J1.c7
RTM_IO3: J1.c8
RTM_IO4: J1.c9
RTM_IO5: J1.c10
RTM_IO6: J2.a1
RTM_IO7: J2.a2
RTM_IO8: J2.c1
RTM_IO9: J2.c2
RTM_IO10: J2.e1
RTM_IO11: J2.e2
RTM_IO12: J1.a7
RTM_IO13: J1.a8
RTM_IO14: J1.a9
RTM_LVD0_N: J1.b6 ; port RTM_LVDS.RTM_LVD0_N  [project net RTM_LVDS.RTM_LVD0_N]
RTM_LVD0_P: J1.a6 ; port RTM_LVDS.RTM_LVD0_P  [project net RTM_LVDS.RTM_LVD0_P]
RTM_LVD1_N: J1.f7 ; port RTM_LVDS.RTM_LVD1_N  [project net RTM_LVDS.RTM_LVD1_N]
RTM_LVD1_P: J1.e7 ; port RTM_LVDS.RTM_LVD1_P  [project net RTM_LVDS.RTM_LVD1_P]
RTM_LVD2_N: J1.f6 ; port RTM_LVDS.RTM_LVD2_N  [project net RTM_LVDS.RTM_LVD2_N]
RTM_LVD2_P: J1.e6 ; port RTM_LVDS.RTM_LVD2_P  [project net RTM_LVDS.RTM_LVD2_P]
RTM_LVD3_N: J1.f5 ; port RTM_LVDS.RTM_LVD3_N  [project net RTM_LVDS.RTM_LVD3_N]
RTM_LVD3_P: J1.e5 ; port RTM_LVDS.RTM_LVD3_P  [project net RTM_LVDS.RTM_LVD3_P]
RTM_LVD4_N: J1.b5 ; port RTM_LVDS.RTM_LVD4_N  [project net RTM_LVDS.RTM_LVD4_N]
RTM_LVD4_P: J1.a5 ; port RTM_LVDS.RTM_LVD4_P  [project net RTM_LVDS.RTM_LVD4_P]
RTM_LVD5_N: J1.f9 ; port RTM_LVDS.RTM_LVD5_N  [project net RTM_LVDS.RTM_LVD5_N]
RTM_LVD5_P: J1.e9 ; port RTM_LVDS.RTM_LVD5_P  [project net RTM_LVDS.RTM_LVD5_P]
RTM_LVD6_N: J1.f10 ; port RTM_LVDS.RTM_LVD6_N  [project net RTM_LVDS.RTM_LVD6_N]
RTM_LVD6_P: J1.e10 ; port RTM_LVDS.RTM_LVD6_P  [project net RTM_LVDS.RTM_LVD6_P]
RTM_LVD7_N: J1.f8 ; port RTM_LVDS.RTM_LVD7_N  [project net RTM_LVDS.RTM_LVD7_N]
RTM_LVD7_P: J1.e8 ; port RTM_LVDS.RTM_LVD7_P  [project net RTM_LVDS.RTM_LVD7_P]
RTM_PS#: J1.c1 ; port RTM_PS#
RTM_SCL: J1.d2 ; port RTM_SCL
RTM_SDA: J1.d1 ; port RTM_SDA
RTM_SYNC_CLK_N: J1.b3 ; port RTM_SYNC_CLK.CLK_N
RTM_SYNC_CLK_P: J1.a3 ; port RTM_SYNC_CLK.CLK_P
SFP1RX_N: J2.d10 ; port SFP_GTP.SFP1RX_N  [project net SFP_GTP.SFP1RX_N]
SFP1RX_P: J2.c10 ; port SFP_GTP.SFP1RX_P  [project net SFP_GTP.SFP1RX_P]
SFP1TX_N: J2.f10 ; port SFP_GTP.SFP1TX_N  [project net SFP_GTP.SFP1TX_N]
SFP1TX_P: J2.e10 ; port SFP_GTP.SFP1TX_P  [project net SFP_GTP.SFP1TX_P]
SFP2RX_N: J2.d9 ; port SFP_GTP.SFP2RX_N  [project net SFP_GTP.SFP2RX_N]
SFP2RX_P: J2.c9 ; port SFP_GTP.SFP2RX_P  [project net SFP_GTP.SFP2RX_P]
SFP2TX_N: J2.f9 ; port SFP_GTP.SFP2TX_N  [project net SFP_GTP.SFP2TX_N]
SFP2TX_P: J2.e9 ; port SFP_GTP.SFP2TX_P  [project net SFP_GTP.SFP2TX_P]
SFP3RX_N: J2.d8 ; port SFP_GTP.SFP3RX_N  [project net SFP_GTP.SFP3RX_N]
SFP3RX_P: J2.c8 ; port SFP_GTP.SFP3RX_P  [project net SFP_GTP.SFP3RX_P]
SFP3TX_N: J2.f8 ; port SFP_GTP.SFP3TX_N  [project net SFP_GTP.SFP3TX_N]
SFP3TX_P: J2.e8 ; port SFP_GTP.SFP3TX_P  [project net SFP_GTP.SFP3TX_P]
SFP4RX_N: J2.d7 ; port SFP_GTP.SFP4RX_N  [project net SFP_GTP.SFP4RX_N]
SFP4RX_P: J2.c7 ; port SFP_GTP.SFP4RX_P  [project net SFP_GTP.SFP4RX_P]
SFP4TX_N: J2.f7 ; port SFP_GTP.SFP4TX_N  [project net SFP_GTP.SFP4TX_N]
SFP4TX_P: J2.e7 ; port SFP_GTP.SFP4TX_P  [project net SFP_GTP.SFP4TX_P]
SFP5RX_N: J2.d6 ; port SFP_GTP.SFP5RX_N  [project net SFP_GTP.SFP5RX_N]
SFP5RX_P: J2.c6 ; port SFP_GTP.SFP5RX_P  [project net SFP_GTP.SFP5RX_P]
SFP5TX_N: J2.f6 ; port SFP_GTP.SFP5TX_N  [project net SFP_GTP.SFP5TX_N]
SFP5TX_P: J2.e6 ; port SFP_GTP.SFP5TX_P  [project net SFP_GTP.SFP5TX_P]
SFP6RX_N: J2.d5 ; port SFP_GTP.SFP6RX_N  [project net SFP_GTP.SFP6RX_N]
SFP6RX_P: J2.c5 ; port SFP_GTP.SFP6RX_P  [project net SFP_GTP.SFP6RX_P]
SFP6TX_N: J2.f5 ; port SFP_GTP.SFP6TX_N  [project net SFP_GTP.SFP6TX_N]
SFP6TX_P: J2.e5 ; port SFP_GTP.SFP6TX_P  [project net SFP_GTP.SFP6TX_P]
SFP7RX_N: J2.d4 ; port SFP_GTP.SFP7RX_N  [project net SFP_GTP.SFP7RX_N]
SFP7RX_P: J2.c4 ; port SFP_GTP.SFP7RX_P  [project net SFP_GTP.SFP7RX_P]
SFP7TX_N: J2.f4 ; port SFP_GTP.SFP7TX_N  [project net SFP_GTP.SFP7TX_N]
SFP7TX_P: J2.e4 ; port SFP_GTP.SFP7TX_P  [project net SFP_GTP.SFP7TX_P]
SFP8RX_N: J2.d3 ; port SFP_GTP.SFP8RX_N  [project net SFP_GTP.SFP8RX_N]
SFP8RX_P: J2.c3 ; port SFP_GTP.SFP8RX_P  [project net SFP_GTP.SFP8RX_P]
SFP8TX_N: J2.f3 ; port SFP_GTP.SFP8TX_N  [project net SFP_GTP.SFP8TX_N]
SFP8TX_P: J2.e3 ; port SFP_GTP.SFP8TX_P  [project net SFP_GTP.SFP8TX_P]
TCK: J1.e1 ; port JTAG.TCK  [project net RTM_TCK]
TDI: J1.e2 ; port JTAG.TDI  [project net RTM_TDI]
TDO: J1.f1 ; port JTAG.TDO  [project net RTM_TDO]
TMS: J1.f2 ; port JTAG.TMS  [project net RTM_TMS]

Not connected (* = marked no-connect by the designer): IC2#2 A2(IO_L20N_T3_37) A3(IO_L20P_T3_37) A4(IO_L15N_T2_DQS_37) A5(IO_L16N_T2_37) A7(IO_L8N_T1_37) A8(IO_L8P_T1_37) A9(IO_L3N_T0_DQS_37) A10(IO_L4N_T0_37) A25(IO_L4N_T0_17) A27(IO_L2N_T0_17) A28(IO_L8P_T1_17) A29(IO_L8N_T1_17) A30(IO_L15N_T2_DQS_17) A32(IO_L17N_T2_17) A33(IO_L20P_T3_17) A34(IO_L20N_T3_17) B1(IO_L22N_T3_37) B2(IO_L21N_T3_DQS_37) B4(IO_L15P_T2_DQS_37) B5(IO_L16P_T2_37) B6(IO_L7N_T1_37) B7(IO_L7P_T1_37) B9(IO_L3P_T0_DQS_37) B10(IO_L4P_T0_37) B11(IO_L1N_T0_37) B25(IO_L4P_T0_17) B26(IO_L3N_T0_DQS_17) B27(IO_L2P_T0_17) B29(IO_L7N_T1_17) B30(IO_L15P_T2_DQS_17) B31(IO_L17P_T2_17) B32(IO_L18N_T2_17) B34(IO_L22N_T3_17) C1(IO_L22P_T3_37) C2(IO_L21P_T3_DQS_37) C3(IO_L19N_T3_VREF_37) C4(IO_L17N_T2_37) C6(IO_L12N_T1_MRCC_37) C7(IO_L12P_T1_MRCC_37) C8(IO_L10N_T1_37) C9(IO_L6N_T0_VREF_37) C11(IO_L1P_T0_37) C26(IO_L3P_T0_DQS_17) C27(IO_L10P_T1_17) C28(IO_L10N_T1_17) C29(IO_L7P_T1_17) C31(IO_L16N_T2_17) C32(IO_L18P_T2_17) C33(IO_L21N_T3_DQS_17) C34(IO_L22P_T3_17) D1(IO_L23N_T3_37) D3(IO_L19P_T3_37) D4(IO_L17P_T2_37) D5(IO_L13N_T2_MRCC_37) D6(IO_L13P_T2_MRCC_37) D8(IO_L10P_T1_37) D9(IO_L6P_T0_37) D10(IO_L5N_T0_37) D11(IO_L2N_T0_37) D24(IO_L1P_T0_17) D25(IO_L1N_T0_17) D26(IO_L5N_T0_17) D28(IO_L12P_T1_MRCC_17) D29(IO_L12N_T1_MRCC_17) D30(IO_L13N_T2_MRCC_17) D31(IO_L16P_T2_17) D33(IO_L21P_T3_DQS_17) D34(IO_L23N_T3_17) E1(IO_L23P_T3_37) E2(IO_L24N_T3_37) E3(IO_L24P_T3_37) E5(IO_L14N_T2_SRCC_37) E6(IO_L14P_T2_SRCC_37) E7(IO_L11N_T1_SRCC_37) E8(IO_L11P_T1_SRCC_37) E10(IO_L5P_T0_37) E11(IO_L2P_T0_37) E25(IO_L6N_T0_VREF_17) E26(IO_L5P_T0_17) E27(IO_L9P_T1_DQS_17) E28(IO_L9N_T1_DQS_17) E30(IO_L13P_T2_MRCC_17) E31(IO_L14N_T2_SRCC_17) E32(IO_L19N_T3_VREF_17) E33(IO_L23P_T3_17) F4(IO_L18N_T2_37) F5(IO_L18P_T2_37) F7(IO_25_37) F8(IO_L9N_T1_DQS_37) F9(IO_L9P_T1_DQS_37) F10(IO_0_37) F24(IO_0_17) F25(IO_L6P_T0_17) F27(IO_25_17) F28(IO_L11P_T1_SRCC_17) F29(IO_L11N_T1_SRCC_17) F30(IO_L14P_T2_SRCC_17) F32(IO_L19P_T3_17) F33(IO_L24P_T3_17) F34(IO_L24N_T3_17); J1 a4 a10 b4 b7 b8 b9 b10 bG4 c4 d4 d5 d6 d7 d8 d9 d10 e3 e4 f3 f4; J2 a3 a4 a6 a7 a8 a10 b1 b2 b3 b4 b6 b7 b8 b10 d1 d2 f1 f2

### Buses and harness runs
bus RTM_IO[14..0]

### Layout directives
net class SE60DE100: CLK_EXT_N, CLK_EXT_P, FPGA_CLK1_N, FPGA_CLK1_P, FPGA_CLK2_N, FPGA_CLK2_P, RTM_LVD0_N, RTM_LVD0_P, RTM_LVD1_N, RTM_LVD1_P, RTM_LVD2_N, RTM_LVD2_P, RTM_LVD3_N, RTM_LVD3_P, RTM_LVD4_N, RTM_LVD4_P, RTM_LVD5_N, RTM_LVD5_P, RTM_LVD6_N, RTM_LVD6_P, RTM_LVD7_N, RTM_LVD7_P, RTM_SYNC_CLK_N, RTM_SYNC_CLK_P, SFP1RX_N, SFP1RX_P, SFP1TX_N, SFP1TX_P, SFP2RX_N, SFP2RX_P, SFP2TX_N, SFP2TX_P, SFP3RX_N, SFP3RX_P, SFP3TX_N, SFP3TX_P, SFP4RX_N, SFP4RX_P, SFP4TX_N, SFP4TX_P, SFP5RX_N, SFP5RX_P, SFP5TX_N, SFP5TX_P, SFP6RX_N, SFP6RX_P, SFP6TX_N, SFP6TX_P, SFP7RX_N, SFP7RX_P, SFP7TX_N, SFP7TX_P, SFP8RX_N, SFP8RX_P, SFP8TX_N, SFP8TX_P
net class DE_SIG: CLK_EXT_N, CLK_EXT_P, FPGA_CLK1_N, FPGA_CLK1_P, FPGA_CLK2_N, FPGA_CLK2_P, RTM_SYNC_CLK_N, RTM_SYNC_CLK_P, SFP1RX_N, SFP1RX_P, SFP1TX_N, SFP1TX_P, SFP2RX_N, SFP2RX_P, SFP2TX_N, SFP2TX_P, SFP3RX_N, SFP3RX_P, SFP3TX_N, SFP3TX_P, SFP4RX_N, SFP4RX_P, SFP4TX_N, SFP4TX_P, SFP5RX_N, SFP5RX_P, SFP5TX_N, SFP5TX_P, SFP6RX_N, SFP6RX_P, SFP6TX_N, SFP6TX_P, SFP7RX_N, SFP7RX_P, SFP7TX_N, SFP7TX_P, SFP8RX_N, SFP8RX_P, SFP8TX_N, SFP8TX_P
differential pair: FPGA_CLK1_N, FPGA_CLK1_P, FPGA_CLK2_N, FPGA_CLK2_P, RTM_SYNC_CLK_N, RTM_SYNC_CLK_P

### Notes on the sheet
- TX - SFP inputs
- RX- SFP outputs
- not present in XC7A200T
- Copyright CNPEM 2012.
  This documentation describes Open Hardware and is licensed under the CERN OHL v.1.1. You may redistribute and modify this documentation under the terms of the CERN OHL v.1.1. (http://ohwr.org/CERNOHL). This documentation is distributed WITHOUT ANY EXPRESS OR IMPLIED WARRANTY, INCLUDING OF MERCHANTABILITY, SATISFACTORY QUALITY AND FITNESS FOR A PARTICULAR PURPOSE. Please see the CERN OHL v.1.1 for applicable conditions.
- Labels drawn without touching a wire or pin: CLK_EXT_N, CLK_EXT_P
- (in symbol XC7A200T-3FFG1156C, part F) BANK 17
- (in symbol XC7A200T-3FFG1156C, part L) BANK 37
- (in symbol XC7A350T-2FFG1156C, part F) BANK 17
- (in symbol XC7A350T-2FFG1156C, part L) BANK 37

### Library data of the parts
B5-B8 = VERO_20-2136: Single Terminal Socket; Part Description: Black Bead PCB Terminal Test Pin (1.32 mm hole); Manufacturer: VERO TECHNOLOGIES; Table: Miscellaneous; Part Number: VERO_20-2136; Component Kind: Standard; Component Type: Standard; Pin Count: 1; Family: Test Point; Mounted: Yes; Socket: No; SMD: No; Status: None; Manufacturer Part Number: 20-2136; ComponentHeight: 5.3mm; HelpURL: \\cern.ch\dfs\Applications\Altium\Datasheets\VERO_20-2136.pdf; Author: CERN DEM JLC; CreateDate: 21/07/2008; LatestRevisionDate: 21/07/2008
IC2#2 = XC7A200T-3FFG1156C: Artix-6 FPGA, 16 GTPs, 600 User I/Os, 1156-Pin BGA, Speed Grade 2, Commercial Grade, Pb-Free; Part Description: Artix-7 FPGA, 16 GTPs, 600 User I/Os, 1156-Pin BGA, Speed Grade 2, Commercial Grade, Pb-Free; Manufacturer: XILINX; Table: Logic; Part Number: XC7A200T-3FFG1156C; Component Kind: Standard; Component Type: Standard; Device: XC7A200T-3FFG1156C; PackageDescription: BGA, 1.00mm Pitch, Square; 1156 Pin, 34 Columns X 34 Rows, 35.00mm X 35.00mm X 3.350mm H; Manufacturer Part Number: XC7A200T-3FFG1156C; Pin Count: 1156; Case: BGA1156; Mounted: Yes; Socket: No; SMD: Yes; ComponentHeight: 3.35mm; HelpURL: \\cern.ch\dfs\Applications\Altium\Datasheets\XC7A350T-2FFG1156C.pdf; ComponentLink1URL: \\cern.ch\dfs\Applications\Altium\Datasheets\XC7A350T-2FFG1156C.pdf; ComponentLink1Description: Package/Pinout; Author: CERN DEM JLC; CreateDate: 2012-09-19; LatestRevisionDate: 2012-09-19
J1 J2 = TYCO_6469081-1: Connector 60 ATCA Female 30 Pairs (60 Signals) + 3x10 Ground; Part Description: 60 Positions, Pitch 2.5mm,  Advanced TCA, Z-PACK HM-Zd Right Angle Press Fit Receptacle; Manufacturer: TYCO ELECTRONICS; Table: TYCO; Part Number: TYCO_6469081-1; Component Kind: Standard; Component Type: Standard; Pin Count: 90; Family: Advanced TCA; Mounted: Yes; Socket: No; SMD: No; Status: None; Manufacturer Part Number: 6469081-1; ComponentHeight: 12.18mm; HelpURL: \\cern.ch\dfs\Applications\Altium\Datasheets\TYCO_6469081-1.pdf; Author: CERN DEM JLC; CreateDate: 2013-08-28; LatestRevisionDate: 2013-08-28
J12 = TYCO_5120913-1: Single Pin Female; Part Number: TYCO_5120913-1
J22 J23 = CON_UFL_SMD: UFL; Supplier 1: Newark; Supplier Part Number 1: 50P8856
TPD2 TPD3 TPD5 TPD6 TPD9 TPD13-TPD16 TPD19-TPD21 TPD24 TPD28-TPD31 TPD33 TPD34 TPD37 TPD38 = TP_DIFF: 1625854-2; Bottom_EstimationX (mm): 0; Document Name: RTM_CON.SchDoc; Part Number: TP_DIFF; ParamsList: Test Point; FootprintSizeX (mm): 4; FootprintSizeY (mm): 2; FootprintRectangleArea (mm): 8; Thickness (Max) (mm): 2; Bottom_EstimationY (mm): 0; Bottom_Area_Estimation (mm): 0; FootprintAlias: TP_SMD_0805